# Altium schematic sheet mcu.SchDoc
size A4
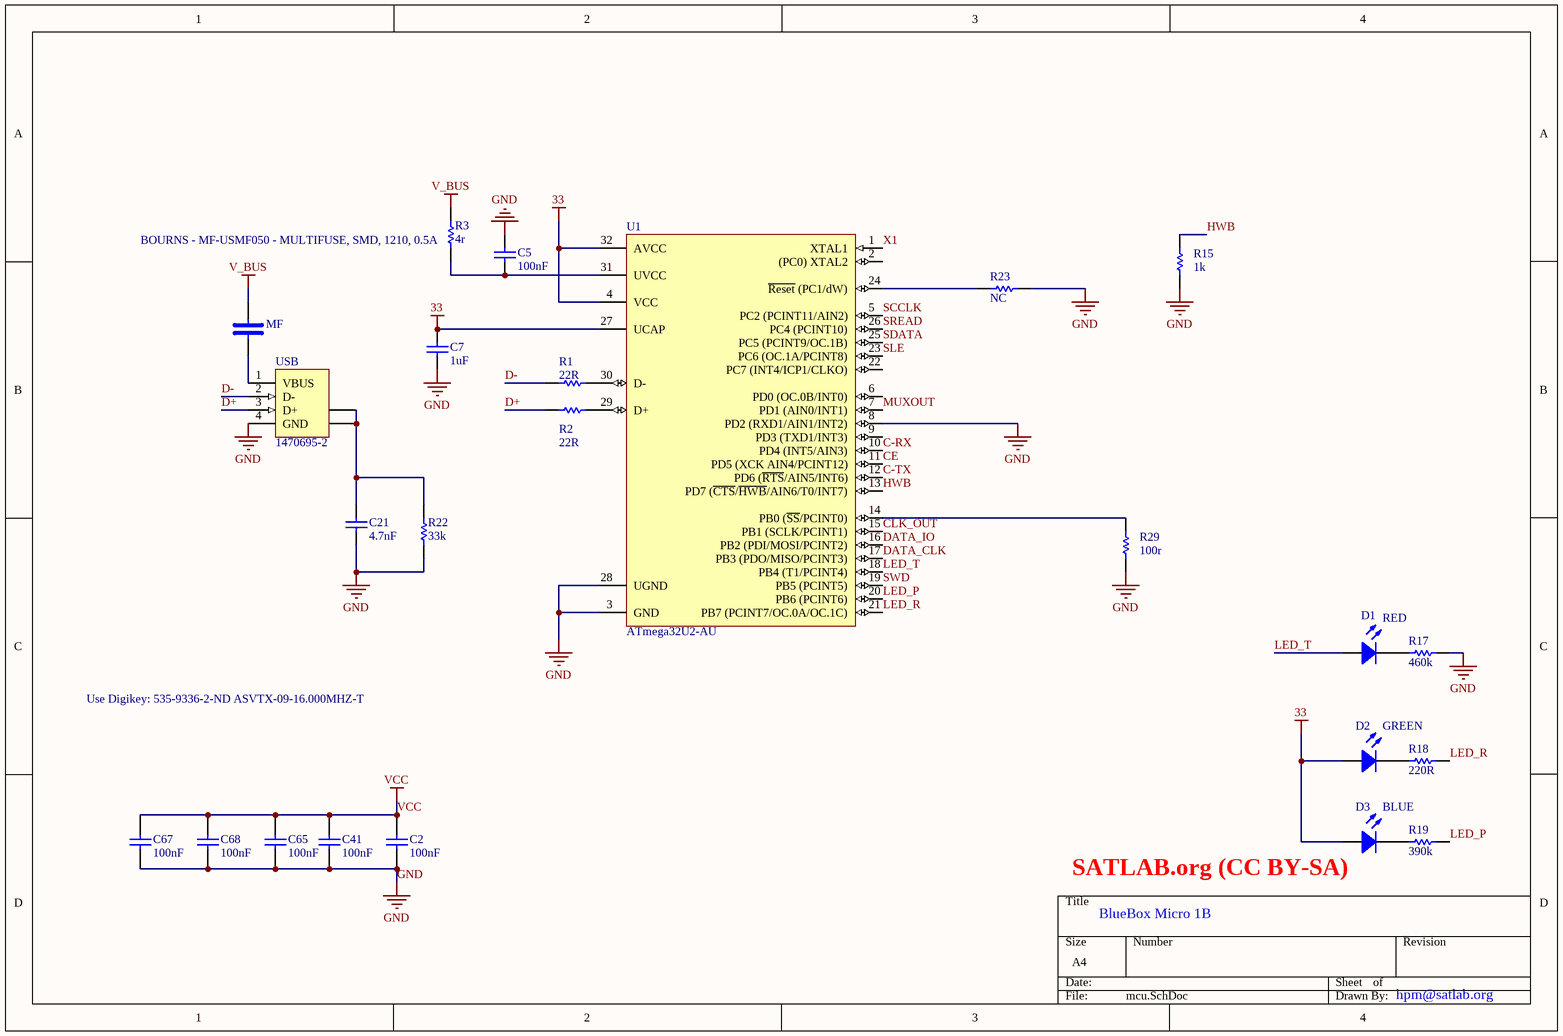
[diagram p0: mcu.SchDoc]

## Parts
C2  value 100nF  [C06]  (hidden comment: Capacitor)
C5  value 100nF  [C06]  (hidden comment: Cap Semi)
C7  value 1uF  [C06]  (hidden comment: Cap Semi)
C21  value 4.7nF  [C06]  (hidden comment: Cap Semi)
C41  value 100nF  [C04]  (hidden comment: Capacitor)
C65  value 100nF  [C04]  (hidden comment: Capacitor)
C67  value 100nF  [C06]  (hidden comment: Capacitor)
C68  value 100nF  [C06]  (hidden comment: Capacitor)
D1  RED  [L06]
D2  GREEN  [L06]
D3  BLUE  [L06]
MF  CapacitorBig  [C1210]  (value not drawn)
R1  value 22R  [R06]  (hidden comment: Resistor)
R2  value 22R  [R06]  (hidden comment: Resistor)
R3  value 4r  [R06]  (hidden comment: Resistor)
R15  value 1k  [R06]  (hidden comment: Resistor)
R17  value 460k  [R06]  (hidden comment: Resistor)
R18  value 220R  [R06]  (hidden comment: Resistor)
R19  value 390k  [R06]  (hidden comment: Resistor)
R22  value 33k  [R06]  (hidden comment: Resistor)
R23  value NC  [R06]  (hidden comment: Resistor)
R29  value 100r  [R06]  (hidden comment: Resistor)
U1  ATmega32U2-AU  [32A_L]
USB  1470695-2  [1470695A]

## Nets
33: C7.1 D2.1(A) D3.1(A) U1.4(VCC) U1.27(UCAP) U1.32(AVCC)
GND: C2.1 C5.1 C7.2 C21.2 C41.2 C65.2 C67.1 C68.1 R15.1 R17.1 R22.2 R23.1 R29.1 U1.3(GND) U1.8(PD2_(RXD1/AIN1/INT2)) U1.28(UGND) USB.4(GND)
V_BUS: MF.1 R3.1
VCC: C2.2 C41.1 C65.1 C67.2 C68.2
C-RX: U1.10(PD4_(INT5/AIN3))
C-TX: U1.12(PD6_(~{RTS}/AIN5/INT6))
CE: U1.11(PD5_(XCK_AIN4/PCINT12))
CLK_OUT: U1.15(PB1_(SCLK/PCINT1))
D+: R2.1 USB.3(D+)
D-: R1.2 USB.2(D-)
DATA_CLK: U1.17(PB3_(PDO/MISO/PCINT3))
DATA_IO: U1.16(PB2_(PDI/MOSI/PCINT2))
HWB: R15.2 U1.13(PD7_(~{CTS}/~{HWB}/AIN6/T0/INT7))
LED_P: R19.1 U1.20(PB6_(PCINT6))
LED_R: R18.1 U1.21(PB7_(PCINT7/OC.0A/OC.1C))
LED_T: D1.1(A) U1.18(PB4_(T1/PCINT4))
MUXOUT: U1.7(PD1_(AIN0/INT1))
SCCLK: U1.5(PC2_(PCINT11/AIN2))
SDATA: U1.25(PC5_(PCINT9/OC.1B))
SLE: U1.23(PC6_(OC.1A/PCINT8))
SREAD: U1.26(PC4_(PCINT10))
SWD: U1.19(PB5_(PCINT5))
X1: U1.1(XTAL1)
NetC5_2: C5.2 R3.2 U1.31(UVCC)
NetC21_1: C21.1 R22.1 USB.5(SHLD) USB.6(SHLD)
NetD1_2: D1.2(K) R17.2
NetD2_2: D2.2(K) R18.2
NetD3_2: D3.2(K) R19.2
NetMF_2: MF.2 USB.1(VBUS)
NetR1_1: R1.1 U1.30(D-)
NetR2_2: R2.2 U1.29(D+)
NetR23_2: R23.2 U1.24(~{Reset}_(PC1/dW))
NetR29_2: R29.2 U1.14(PB0_(~{SS}/PCINT0))

Not connected (* = marked no-connect by the designer): U1 2((PC0)_XTAL2) 6(PD0_(OC.0B/INT0)) 9(PD3_(TXD1/INT3)) 22(PC7_(INT4/ICP1/CLKO))

## Notes on the sheet
- (near R3) BOURNS - MF-USMF050 - MULTIFUSE, SMD, 1210, 0.5A
- Use Digikey: 535-9336-2-ND ASVTX-09-16.000MHZ-T
- (near D3) SATLAB.org (CC BY-SA)
- BlueBox Micro 1B
- hpm@satlab.org

## Library data of the parts
C2 C41 C65 C67 C68 = Capacitor: Capacitor, standard
C5 C7 C21 = Cap Semi: Capacitor (Semiconductor SIM Model); Published: 8-Jun-2000; LatestRevisionDate: 29-May-2009; LatestRevisionNote: IPC-7351 Footprint Added.; PackageReference: C1206; Publisher: Altium Limited; PackageDescription: Chip Capacitor
D1-D3 = LED: Typical RED GaAs LED; Published: 8-Jun-2000; LatestRevisionDate: 08-Jul-2005; LatestRevisionNote: Mech Layer 1 removed.; PackageReference: LED-1; Publisher: Altium Limited
MF = CapacitorBig: Capacitor for PRU etc.; By: Troels Jessen; Username: tjessen; Datasheet: http://search.murata.co.jp/Ceramy/image/img/w_hinm/L0005E.pdf; DigiKey: 490-5314-1-ND
R1-R3 R15 R17-R19 R22 R23 R29 = Resistor: By: Troels Jessen; Username: tjessen
U1 = ATmega32U2-AU: 8-bit AVR Microcontroller, 2.7-5.5V, 32KB Flash, 1KB EEPROM, 1KB SRAM, 32-pin TQFP, Industrial Grade (-40°C to 85°C); DatasheetVersion: revD, Nov-2010; PackageVersion: revC, Oct-2010; PackageReference: 32A; PackageDescription: 32-Lead, 7x7x1.0 mm Body, 0.8mm Lead Pitch, Thin Profile Plastic Quad Flat Package (TQFP); Code_JEDEC: MS-026-ABA; ComponentLink1Description: Manufacturer URL; ComponentLink1URL: http://www.atmel.com/; ComponentLink2Description: ATmega8U2/16U2/32U2 Datasheet; ComponentLink2URL: http://www.atmel.com/dyn/resources/prod_documents/doc7799.pdf; ComponentLink3Description: ATmega8U2/16U2/32U2 Summary; ComponentLink3URL: http://www.atmel.com/dyn/resources/prod_documents/7799S.pdf
USB = 1470695-2: USB 1.1, Right Angle, SMT, A Type, Plug, 4 Position, Natural; ContactMaterial: Brass; ContactPlating: Gold (30) over Nickel (50); PCB_Layout: Complies with manufacturer's recommendation.; DrillSize: Corresponds to nominal value.; PanelGround: Without; Published: 15-Jul-2004; DatasheetDocument: 21-Jan-2003; PackageDocument: 21-Jan-2003; PackageReference: 1470695A; Publisher: Altium Limited; HousingMaterial: Thermoplastic; ComponentLink1Description: Manufacturer Link; ComponentLink1URL: http://www.tycoelectronics.com/; ComponentLink2Description: Packaging Specification; ComponentLink2URL: http://ecommas.tycoelectronics.com/commerce/DocumentDelivery/DDEController?Action=showdoc&DocId=Customer+Drawing%7F1470695%7FO%7Fpdf%7FEnglish%7FC_1470695_O.pdf